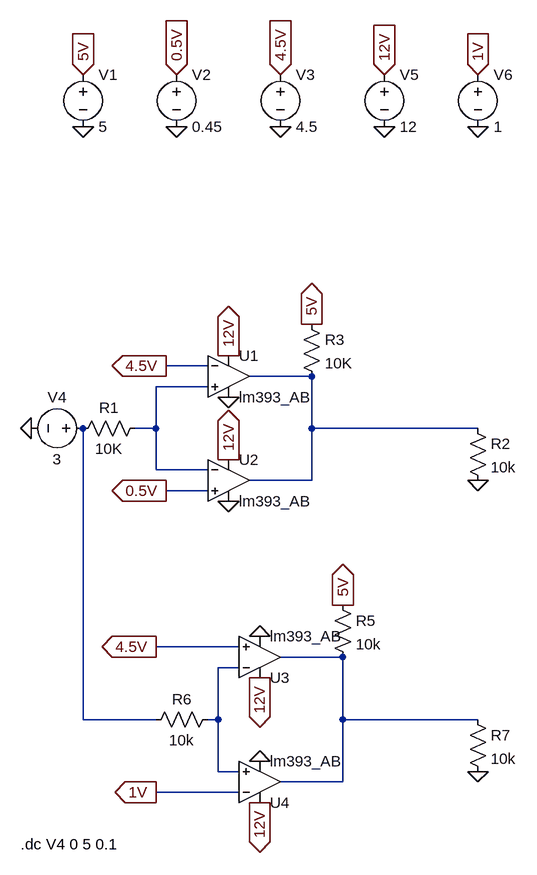
[diagram p0: schematic BrakePressureCompSingle.asc]
BrakePressureCompSingle.asc, the LTspice schematic file:
Version 4
SHEET 1 976 856
WIRE 128 80 64 80
WIRE 288 96 192 96
WIRE 128 112 48 112
WIRE 48 176 48 112
WIRE 48 176 16 176
WIRE 288 176 288 96
WIRE 544 176 288 176
WIRE 48 240 48 176
WIRE 128 240 48 240
WIRE 288 256 288 176
WIRE 288 256 192 256
WIRE 128 272 64 272
WIRE 176 512 48 512
WIRE 336 528 240 528
WIRE 176 544 144 544
WIRE -64 624 -64 176
WIRE 48 624 -64 624
WIRE 144 624 144 544
WIRE 144 624 128 624
WIRE 336 624 336 528
WIRE 544 624 336 624
WIRE 144 704 144 624
WIRE 176 704 144 704
WIRE 336 720 336 624
WIRE 336 720 240 720
WIRE 176 736 48 736
FLAG -64 -288 0
FLAG 160 288 0
FLAG 160 128 0
FLAG -64 -368 5V
IOPIN -64 -368 In
FLAG 80 -288 0
FLAG 240 -288 0
FLAG 80 -368 0.5V
IOPIN 80 -368 In
FLAG 240 -368 4.5V
IOPIN 240 -368 In
FLAG 64 80 4.5V
IOPIN 64 80 Out
FLAG 64 272 0.5V
IOPIN 64 272 Out
FLAG -144 176 0
FLAG 288 16 5V
IOPIN 288 16 Out
FLAG 400 -288 0
FLAG 400 -368 12V
IOPIN 400 -368 In
FLAG 160 64 12V
IOPIN 160 64 Out
FLAG 160 224 12V
IOPIN 160 224 Out
FLAG 208 560 12V
IOPIN 208 560 Out
FLAG 208 752 12V
IOPIN 208 752 Out
FLAG 208 496 0
FLAG 208 688 0
FLAG 336 448 5V
IOPIN 336 448 Out
FLAG 544 704 0
FLAG 544 256 0
FLAG 544 -288 0
FLAG 544 -368 1V
IOPIN 544 -368 In
FLAG 48 736 1V
IOPIN 48 736 Out
FLAG 48 512 4.5V
IOPIN 48 512 Out
SYMBOL voltage -64 -384 R0
WINDOW 123 0 0 Left 0
WINDOW 39 0 0 Left 0
SYMATTR InstName V1
SYMATTR Value 5
SYMBOL res 32 160 R90
WINDOW 0 0 56 VBottom 2
WINDOW 3 32 56 VTop 2
SYMATTR InstName R1
SYMATTR Value 10K
SYMATTR SpiceLine tol=1 pwr=0.1
SYMBOL voltage 80 -384 R0
WINDOW 123 0 0 Left 0
WINDOW 39 0 0 Left 0
SYMATTR InstName V2
SYMATTR Value 0.45
SYMBOL voltage 240 -384 R0
WINDOW 123 0 0 Left 0
WINDOW 39 0 0 Left 0
SYMATTR InstName V3
SYMATTR Value 4.5
SYMBOL voltage -48 176 R90
WINDOW 0 -32 56 VBottom 2
WINDOW 3 32 56 VTop 2
WINDOW 123 0 0 Left 0
WINDOW 39 0 0 Left 0
SYMATTR InstName V4
SYMATTR Value 3
SYMBOL res 272 0 R0
SYMATTR InstName R3
SYMATTR Value 10K
SYMATTR SpiceLine tol=1 pwr=0.1
SYMBOL voltage 400 -384 R0
WINDOW 123 0 0 Left 0
WINDOW 39 0 0 Left 0
SYMATTR InstName V5
SYMATTR Value 12
SYMBOL res 320 432 R0
SYMATTR InstName R5
SYMATTR Value 10k
SYMBOL res 144 608 R90
WINDOW 0 0 56 VBottom 2
WINDOW 3 32 56 VTop 2
SYMATTR InstName R6
SYMATTR Value 10k
SYMBOL res 528 160 R0
SYMATTR InstName R2
SYMATTR Value 10k
SYMBOL res 528 608 R0
SYMATTR InstName R7
SYMATTR Value 10k
SYMBOL voltage 544 -384 R0
WINDOW 123 0 0 Left 0
WINDOW 39 0 0 Left 0
SYMATTR InstName V6
SYMATTR Value 1
SYMBOL ZZZ\\Comparator\\lm393_AB 160 96 R0
SYMATTR InstName U1
SYMBOL ZZZ\\Comparator\\lm393_AB 160 256 R0
SYMATTR InstName U2
SYMBOL ZZZ\\Comparator\\lm393_AB 208 528 M180
SYMATTR InstName U3
SYMBOL ZZZ\\Comparator\\lm393_AB 208 720 M180
SYMATTR InstName U4
TEXT -160 816 Left 2 !.dc V4 0 5 0.1

The netlist it stands for:
* BrakePressureCompSingle.asc
V1 5V 0 5
R1 N002 N005 10K tol=1 pwr=0.1
V2 0.5V 0 0.45
V3 4.5V 0 4.5
V4 N005 0 3
R3 5V N001 10K tol=1 pwr=0.1
V5 12V 0 12
R5 5V N003 10k
R6 N004 N005 10k
R2 N001 0 10k
R7 N003 0 10k
V6 1V 0 1
* U1: lm393_AB (symbol ZZZ\Comparator\lm393_AB not available, pins judged from their places): In+=N002 In-=4.5V V+=12V V-=0 OUT=N001
* U2: lm393_AB (symbol ZZZ\Comparator\lm393_AB not available, pins judged from their places): In+=0.5V In-=N002 V+=12V V-=0 OUT=N001
* U3: lm393_AB (symbol ZZZ\Comparator\lm393_AB not available, pins judged from their places): In+=4.5V In-=N004 V+=12V V-=0 OUT=N003
* U4: lm393_AB (symbol ZZZ\Comparator\lm393_AB not available, pins judged from their places): In+=N004 In-=1V V+=12V V-=0 OUT=N003
.dc V4 0 5 0.1
.backanno
.end